# Altium schematic sheet Sheet1.SchDoc
size A4
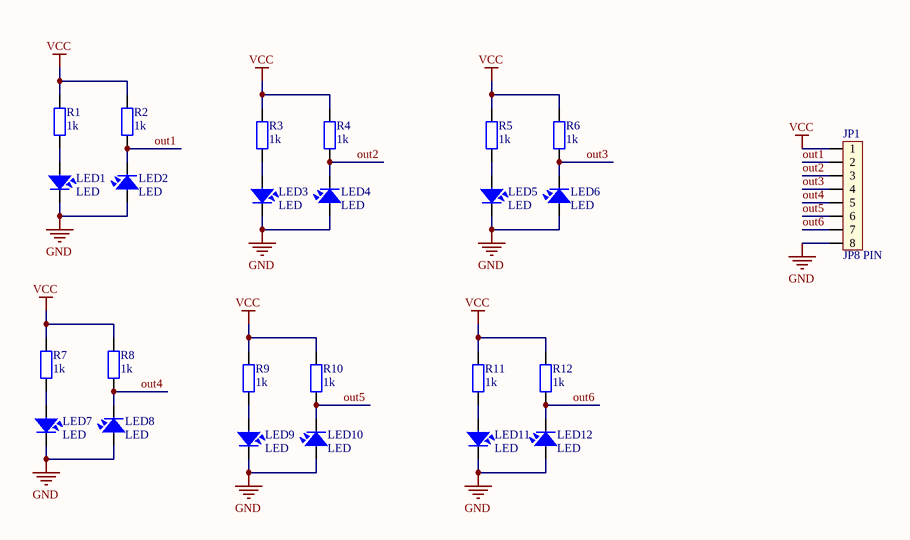
[diagram p0: Sheet1.SchDoc]

## Parts
JP1  JP8 PIN  [JP8]
LED1  LED  [LED-3]
LED2  LED  [LED-3]
LED3  LED  [LED-3]
LED4  LED  [LED-3]
LED5  LED  [LED-3]
LED6  LED  [LED-3]
LED7  LED  [LED-3]
LED8  LED  [LED-3]
LED9  LED  [LED-3]
LED10  LED  [LED-3]
LED11  LED  [LED-3]
LED12  LED  [LED-3]
R1  1k  [R1/4W]
R2  1k  [R1/4W]
R3  1k  [R1/4W]
R4  1k  [R1/4W]
R5  1k  [R1/4W]
R6  1k  [R1/4W]
R7  1k  [R1/4W]
R8  1k  [R1/4W]
R9  1k  [R1/4W]
R10  1k  [R1/4W]
R11  1k  [R1/4W]
R12  1k  [R1/4W]

## Nets
GND: JP1.8 LED1.2 LED2.1 LED3.2 LED4.1 LED5.2 LED6.1 LED7.2 LED8.1 LED9.2 LED10.1 LED11.2 LED12.1
VCC: JP1.1 R1.2 R2.2 R3.2 R4.2 R5.2 R6.2 R7.2 R8.2 R9.2 R10.2 R11.2 R12.2
out1: JP1.2 LED2.2 R2.1
out2: JP1.3 LED4.2 R4.1
out3: JP1.4 LED6.2 R6.1
out4: JP1.5 LED8.2 R8.1
out5: JP1.6 LED10.2 R10.1
out6: JP1.7 LED12.2 R12.1
NetLED1_1: LED1.1 R1.1
NetLED3_1: LED3.1 R3.1
NetLED5_1: LED5.1 R5.1
NetLED7_1: LED7.1 R7.1
NetLED9_1: LED9.1 R9.1
NetLED11_1: LED11.1 R11.1

## Library data of the parts
JP1 = JP8: Value: JP7
LED1-LED12 = LED: LED Single colour Green and Red; Value: LED 3 ly Single Colour
R1-R12 = R1/4W: Resistor 1/4W; Value: R1/4W - 1K